# Altium project USBasp_下载线.PrjPCB
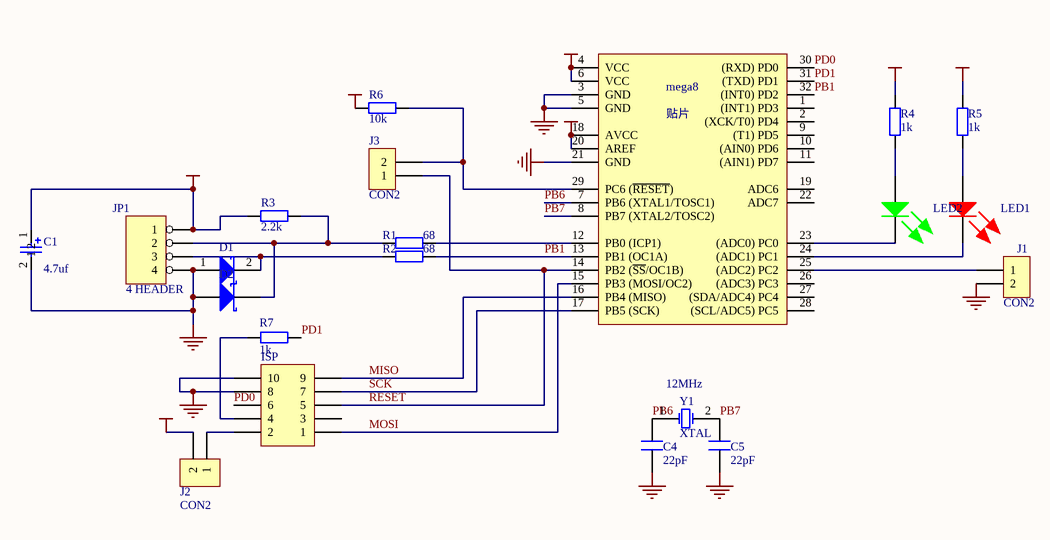
[diagram p0: USBasp_下载线.SchDoc]
1 sheet, 21 parts. Net scope: global (net labels, ports and power ports of the same name join across sheets).
Board file: USBasp_下载线.PCBDOC

## Sheet USBasp_下载线.SchDoc
size A4

### Parts
C1  value 4.7uf  [TPDR]
C4  value 22pF  [TP-0805-R]
C5  value 22pF  [TP-0805-R]
D1  Diode 11DQ03  [TPDR]  (value not drawn)
D2  Diode 11DQ03  [TPDR]  (value not drawn)
ISP  (no value)  [HDR2X5]
J1  CON2  [HDR1X2]
J2  CON2  [HDR1X2]
J3  CON2  [HDR1X2]
JP1  4 HEADER  [USB-5V]
LED1  (no value)  [TP-0805-D]
LED2  (no value)  [TP-0805-D]
mega8  贴片  [QFP7x7-G32/N]
R1  value 68  [TP-0805-R]
R2  value 68  [TP-0805-R]
R3  value 2.2k  [TP-0805-R]
R4  value 1k  [TP-0805-R]
R5  value 1k  [TP-0805-R]
R6  value 10k  [TP-0805-R]
R7  value 1k  [TP-0805-R]
Y1  XTAL  value 12MHz  [JZ_ZC]

### Nets
GND: C1.2 C4.1 C5.1 D1.1(A) D2.1(A) ISP.8 ISP.10 J1.2 JP1.4 mega8.3(GND) mega8.5(GND) mega8.21(GND)
VCC: C1.1 J2.2 JP1.1 mega8.4(VCC) mega8.6(VCC) mega8.18(AVCC) mega8.20(AREF) R3.2 R4.2 R5.2 R6.2
MISO: ISP.9 mega8.16(PB4_(MISO))
MOSI: ISP.1 mega8.15(PB3_(MOSI/OC2))
PB1: mega8.13(PB1_(OC1A)) mega8.32((INT0)_PD2) R2.1
PB6: C4.2 mega8.7(PB6_(XTAL1/TOSC1)) Y1.1(OSC1)
PB7: C5.2 mega8.8(PB7_(XTAL2/TOSC2)) Y1.2(OSC2)
PD0: ISP.6 mega8.30((RXD)_PD0)
PD1: mega8.31((TXD)_PD1) R7.2
RESET: ISP.5 J3.1 mega8.14(PB2_(~{SS}/OC1B))
SCK: ISP.7 mega8.17(PB5_(SCK))
NetD1_2: D1.2(K) JP1.3 R2.2
NetD2_2: D2.2(K) JP1.2 R1.1 R3.1
NetISP_2: ISP.2 J2.1
NetISP_4: ISP.4 R7.1
NetJ1_1: J1.1 mega8.25((ADC2)_PC2)
NetJ3_2: J3.2 mega8.29(PC6_(~{RESET})) R6.1
NetLED1_1: LED1.1 R5.1
NetLED1_2: LED1.2 mega8.24((ADC1)_PC1)
NetLED2_1: LED2.1 R4.1
NetLED2_2: LED2.2 mega8.23((ADC0)_PC0)
Netmega8_12: mega8.12(PB0_(ICP1)) R1.2

Not connected (* = marked no-connect by the designer): ISP 3; mega8 1((INT1)_PD3) 2((XCK/T0)_PD4) 9((T1)_PD5) 10((AIN0)_PD6) 11((AIN1)_PD7) 19(ADC6) 22(ADC7) 26((ADC3)_PC3) 27((SDA/ADC4)_PC4) 28((SCL/ADC5)_PC5)

### Library data of the parts
C1 = Cap Pol2: Polarized Capacitor (Axial); Published: 8-Jun-2000; LatestRevisionDate: 17-Jul-2002; LatestRevisionNote: Re-released for DXP Platform.; Publisher: Altium Limited
C4 C5 = CAPSMD: Capacitor SMD1206; Bolt: RET; Kód: 93-00-19
D1 D2 = Diode 11DQ03: Schottky Rectifier; Published: 8-Jun-2000; LatestRevisionDate: 17-Jul-2002; LatestRevisionNote: Re-released for DXP Platform.; DatasheetDocument: Dec-1997; PackageReference: DO-204AL; Publisher: Altium Limited; Code_JEDEC: DO-204-AL
ISP = MLW10A: Header, 5-Pin, Dual row, Right Angle; Manufacturer: Generic Components; Class: Connector; Bolt: RET; Kód: 53-02-64
J1-J3 = CON2: Connector
JP1 = 4 HEADER: 4 Pin Header
LED1 = LED Piros: Piros Led 3mm; Bolt: RET; Kód: 46-01-40; Value: Piros
LED2 = LED Zöld: Zöld Led 3mm; Bolt: RET; Kód: 46-01-42; Value: Zöld
mega8 = ATmega8-A: 8 位微处理器/32引脚; 子类别: 微处理器; 发布者: 磊元工作室; 发布日期: 2003年8月18日; 制造商: Atmel Corporation; 类别: 集成电路; 元件名称（国标）: 8 位微处理器; 元件名称（英文）: 8-bit Microcontroller; 特性:存储器容量: Flash：8KB ，EEPROM：512B ，RAM：1KB; 特性:定时器/计数器: 2 个 8-bit ，1 个 16-bit; 特性:模/数转换器: 8 通道 10-bit ADC; 特性:指令: 两个时钟周期的硬件乘法器
R1-R7 = RES: Resistor SMD1206, 1% fémréteg; Bolt: RET; Kód: 96-00-73
Y1 = XTAL: Crystal Oscillator; Manufacturer: Generic Components; Bolt: RET; Published: 08/06/2000; Publisher: Altium Hobart Technology Centre; Class: Oscillator; SubClass: Crystal Oscillator; Kód: 62-00-45